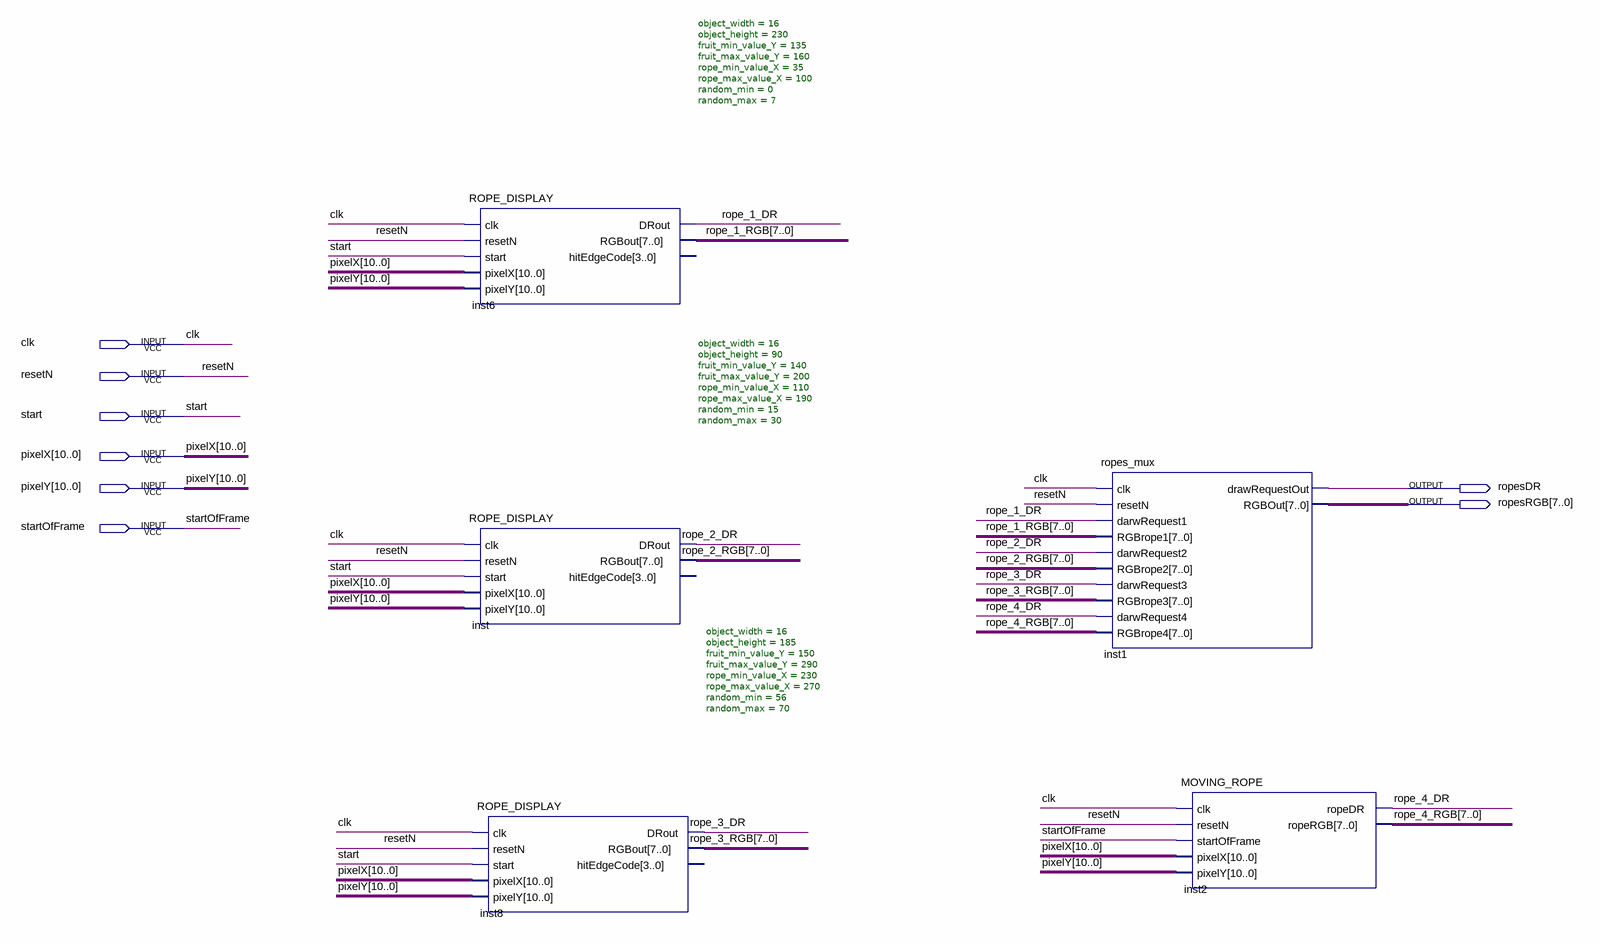
[diagram p0: schematic sheet]
// Quartus schematic Lab1Demo.bdf as structural Verilog: 5 symbols, 8 pins
module Lab1Demo (
  input  clk,
  input  resetN,
  input  start,
  input  [10:0] pixelX,
  input  [10:0] pixelY,
  input  startOfFrame,
  output ropesDR,
  output [7:0] ropesRGB
);

  wire rope_1_DR, rope_2_DR, rope_3_DR, rope_4_DR;
  wire [7:0] rope_1_RGB, rope_2_RGB, rope_3_RGB, rope_4_RGB;

  ROPE_DISPLAY #(.object_width(16), .object_height(230), .fruit_min_value_Y(135), .fruit_max_value_Y(160), .rope_min_value_X(35), .rope_max_value_X(100), .random_min(0), .random_max(7)) inst6 (
    .clk(clk), .resetN(resetN), .start(start), .pixelX(pixelX), .pixelY(pixelY), .DRout(rope_1_DR),
    .RGBout(rope_1_RGB));  // open: hitEdgeCode
  ROPE_DISPLAY #(.object_width(16), .object_height(90), .fruit_min_value_Y(140), .fruit_max_value_Y(200), .rope_min_value_X(110), .rope_max_value_X(190), .random_min(15), .random_max(30)) inst (
    .clk(clk), .resetN(resetN), .start(start), .pixelX(pixelX), .pixelY(pixelY), .DRout(rope_2_DR),
    .RGBout(rope_2_RGB));  // open: hitEdgeCode
  ROPE_DISPLAY #(.object_width(16), .object_height(185), .fruit_min_value_Y(150), .fruit_max_value_Y(290), .rope_min_value_X(230), .rope_max_value_X(270), .random_min(56), .random_max(70)) inst8 (
    .clk(clk), .resetN(resetN), .start(start), .pixelX(pixelX), .pixelY(pixelY), .DRout(rope_3_DR),
    .RGBout(rope_3_RGB));  // open: hitEdgeCode
  ropes_mux inst1 (
    .clk(clk), .resetN(resetN), .darwRequest1(rope_1_DR), .RGBrope1(rope_1_RGB), .darwRequest2(rope_2_DR),
    .RGBrope2(rope_2_RGB), .darwRequest3(rope_3_DR), .RGBrope3(rope_3_RGB), .darwRequest4(rope_4_DR),
    .RGBrope4(rope_4_RGB), .drawRequestOut(ropesDR), .RGBOut(ropesRGB));
  MOVING_ROPE inst2 (
    .clk(clk), .resetN(resetN), .startOfFrame(startOfFrame), .pixelX(pixelX), .pixelY(pixelY),
    .ropeDR(rope_4_DR), .ropeRGB(rope_4_RGB));
endmodule
